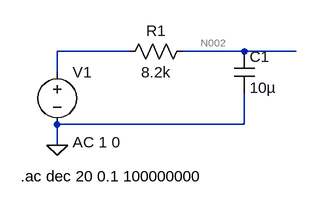
[diagram p0: schematic DACLowPass.asc]
DACLowPass.asc, the LTspice schematic file:
Version 4
SHEET 1 880 680
WIRE 192 80 80 80
WIRE 368 80 272 80
WIRE 448 80 368 80
WIRE 80 112 80 80
WIRE 368 192 368 144
WIRE 368 192 80 192
WIRE 80 224 80 192
FLAG 80 224 0
SYMBOL voltage 80 96 R0
WINDOW 123 24 124 Left 2
WINDOW 39 0 0 Left 2
SYMATTR Value2 AC 1 0
SYMATTR InstName V1
SYMATTR Value ""
SYMBOL res 288 64 R90
WINDOW 0 0 56 VBottom 2
WINDOW 3 32 56 VTop 2
SYMATTR InstName R1
SYMATTR Value 8.2k
SYMBOL cap 352 80 R0
SYMATTR InstName C1
SYMATTR Value 10µ
TEXT 24 272 Left 2 !.ac dec 20 0.1 100000000

The netlist it stands for:
* DACLowPass.asc
V1 N001 0 AC 1 0
R1 N002 N001 8.2k
C1 N002 0 10µ
.ac dec 20 0.1 100000000
.backanno
.end

* Results of the author's LTspice run, read from the files saved beside the schematic
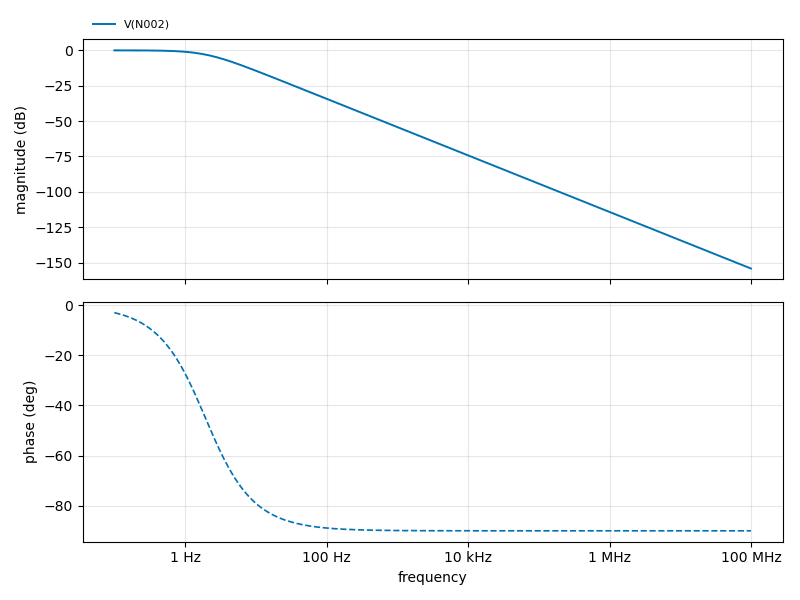
[diagram p1: AC Analysis of DACLowPass.asc, plotted from the saved traces]
* AC Analysis, 1 run:
*   V(N002): -0.01 dB at 100 mHz, -154.24 dB at 100 MHz, peak -0.01 dB at 100 mHz, 3 dB below the peak at 1.944 Hz